# Altium schematic sheet MCU063B_USB.SchDoc
size 431 x 279 mm; Date: Not shown in title block; ApprovedBy: Not shown in title block; CheckedBy: Not shown in title block; Author: Not shown in title block; CompanyName: Not shown in title block; DrawnBy: Cody Watkins; Engineer: Not shown in title block; Organization: Not shown in title block; Address1: Not shown in title block; Address2: Not shown in title block; Address3: Not shown in title block; Address4: Not shown in title block; DocumentNumber: 6; Revision: Use project parameter SCH_Rev; SheetNumber: 6; SheetTotal: 11; PageSetup: Record=PageOptions|CenterHorizontal=True|CenterVertical=True|PrintScale=1.00|XCorrection=1.00|YCorrection=1.00|PrintKind=0|BorderSize=5000000|LeftOffset=0|BottomOffset=0|Orientation=2|PaperLength=1000|PaperWidth=1000|Scale=100|PaperSource=15|PrintQuality=600|MediaType=1|DitherType=10|PaperKind=Letter|PrintScaleMode=1; CurrentTime: Not shown in title block; CurrentDate: Not shown in title block; Time: Not shown in title block; DocumentFullPathAndName: Not shown in title block; DocumentName: Not shown in title block; ModifiedDate: Not shown in title block; ImagePath: Not shown in title block
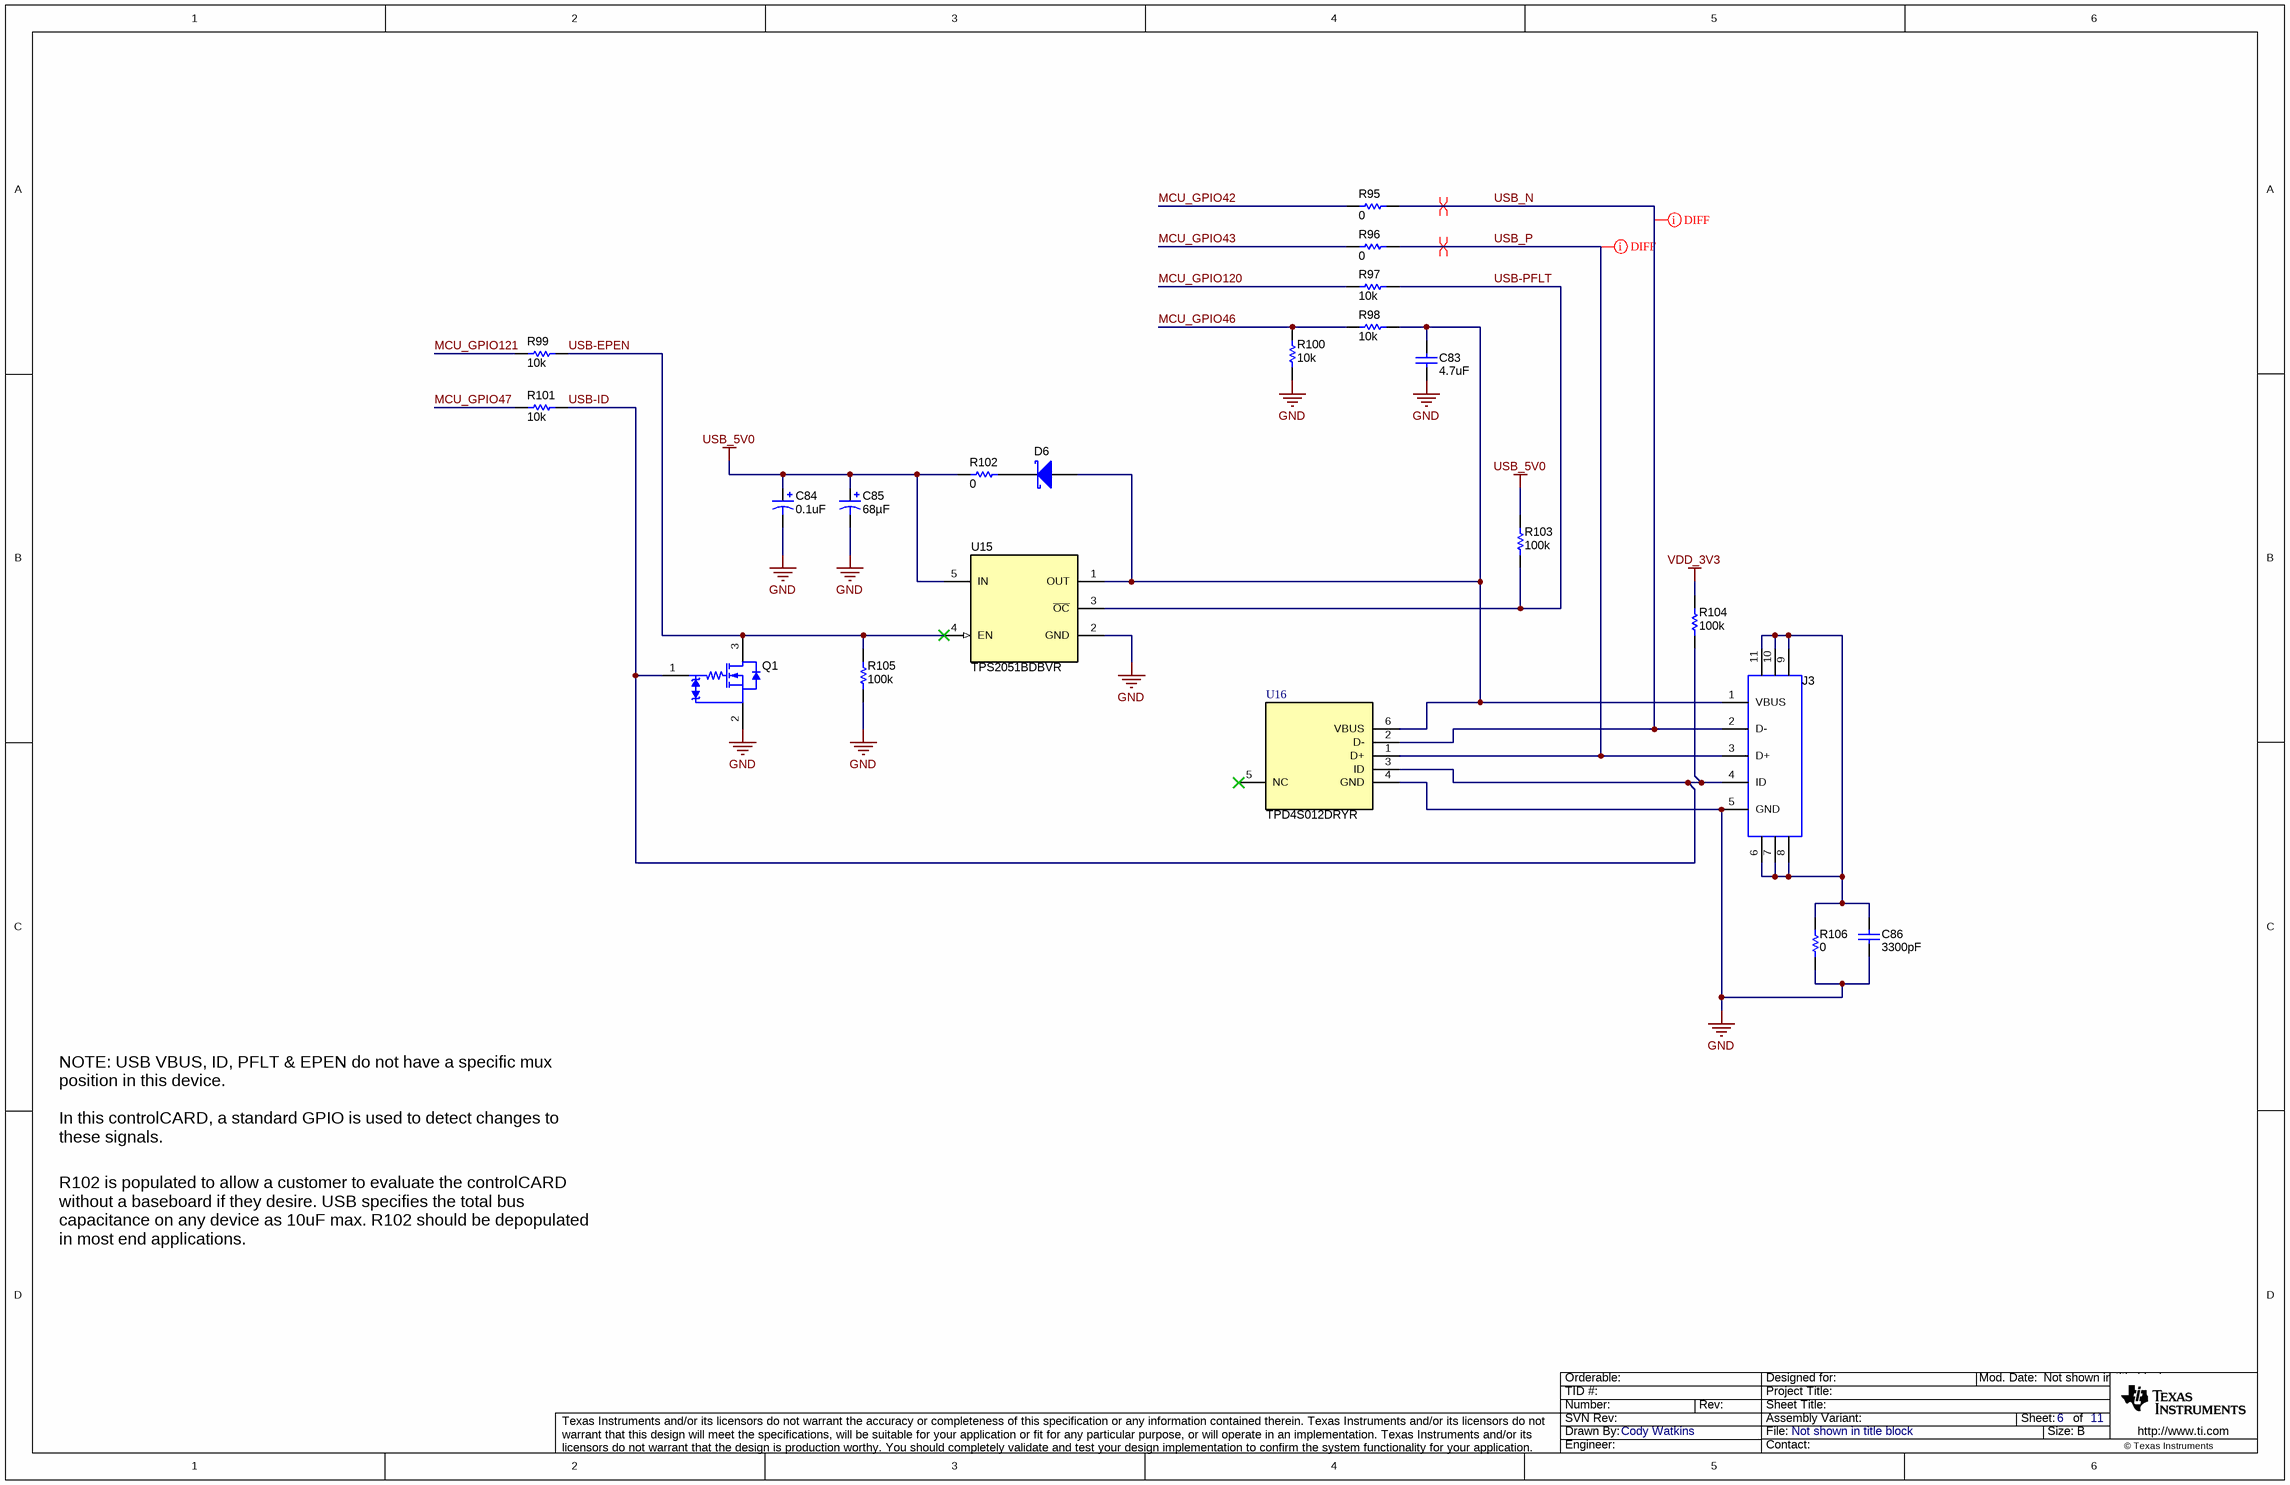
[diagram p0: MCU063B_USB.SchDoc]

## Parts
C83  ValueDisplayed: 4.7uF  [0603]  (hidden comment: C0603C475K9PACTU)
C84  ValueDisplayed: 0.1uF  [3216-18]  (hidden comment: 293D104X9035A2TE3)
C85  ValueDisplayed: 68µF  [3216-18]  (hidden comment: TLJA686M010R1500)
C86  ValueDisplayed: 3300pF  [0402]  (hidden comment: CGA2B2X7R1H332K050BA)
D6  MBRM110ET1G  [POWERMITE]  (value not drawn)
J3  1051640001  [Molex_1051640001]  (value not drawn)
Q1  NTA7002NT1G  [SOT-416]  (value not drawn)
R95  ValueDisplayed: 0  [0402]  (hidden comment: CRCW04020000Z0ED)
R96  ValueDisplayed: 0  [0402]  (hidden comment: CRCW04020000Z0ED)
R97  ValueDisplayed: 10k  [0805_HV]  (hidden comment: ERJ-6GEYJ103V)
R98  ValueDisplayed: 10k  [0805_HV]  (hidden comment: ERJ-6GEYJ103V)
R99  ValueDisplayed: 10k  [0805_HV]  (hidden comment: ERJ-6GEYJ103V)
R100  ValueDisplayed: 10k  [0805_HV]  (hidden comment: ERJ-6GEYJ103V)
R101  ValueDisplayed: 10k  [0805_HV]  (hidden comment: ERJ-6GEYJ103V)
R102  ValueDisplayed: 0  [0402]  (hidden comment: CRCW04020000Z0ED)
R103  ValueDisplayed: 100k  [0603]  (hidden comment: ERJ-3GEYJ104V)
R104  ValueDisplayed: 100k  [0603]  (hidden comment: ERJ-3GEYJ104V)
R105  ValueDisplayed: 100k  [0603]  (hidden comment: ERJ-3GEYJ104V)
R106  ValueDisplayed: 0  [0402]  (hidden comment: CRCW04020000Z0ED)
U15  TPS2051BDBVR  [DBV0005A_N]
U16  TPD4S012DRYR  [DRY0006A]

## Nets
GND: C83.2 C84.2(-) C85.2(-) C86.1 J3.5(GND) Q1.2(S) R100.1 R105.2 R106.2 U15.2(GND) U16.4(GND)
USB_5V0: C84.1(+) C85.1(+) R102.1 R103.1 U15.5(IN)
VDD_3V3: R104.1
MCU_GPIO42: R95.1
MCU_GPIO43: R96.1
MCU_GPIO46: R98.1 R100.2
MCU_GPIO47: R101.1
MCU_GPIO120: R97.1
MCU_GPIO121: R99.1
USB-EPEN: Q1.3(D) R99.2 R105.1 U15.4(EN)
USB-ID: J3.4(ID) Q1.1(G) R101.2 R104.2 U16.3(ID)
USB-PFLT: R97.2 R103.2 U15.3(~{OC})
USB_N: J3.2(D-) R95.2 U16.2(D-)
USB_P: J3.3(D+) R96.2 U16.1(D+)
NetC83_1: C83.1 D6.2(A) J3.1(VBUS) R98.2 U15.1(OUT) U16.6(VBUS)
NetC86_2: C86.2 J3.6 J3.7 J3.8 J3.9 J3.10 J3.11 R106.1
NetD6_1: D6.1(K) R102.2

Not connected (* = marked no-connect by the designer): U16 5(NC)*

## Layout directives
differential pair: USB_N, USB_P
net class USB: USB_N, USB_P

## Notes on the sheet
- NOTE: USB VBUS, ID, PFLT & EPEN do not have a specific mux position in this device.
  In this controlCARD, a standard GPIO is used to detect changes to these signals.
- R102 is populated to allow a customer to evaluate the controlCARD without a baseboard if they desire. USB specifies the total bus capacitance on any device as 10uF max. R102 should be depopulated in most end applications.
- Drawn By:
- SVN Rev:
- Number:
- TID #:
- Orderable:
- Rev:
- Sheet Title:
- File:
- Project Title:
- Designed for:
- Assembly Variant:
- Mod. Date:
- Sheet:
- Size:
- of
- B
- http://www.ti.com
- Texas Instruments and/or its licensors do not warrant the accuracy or completeness of this specification or any information contained therein. Texas Instruments and/or its licensors do not warrant that this design will meet the specifications, will be suitable for your application or fit for any particular purpose, or will operate in an implementation. Texas Instruments and/or its licensors do not warrant that the design is production worthy. You should completely validate and test your design implementation to confirm the system functionality for your application.
- Engineer:
- Contact:
- © Texas Instruments

## Library data of the parts
C83 = CMP-0006950-5: CAP, CERM, 4.7 uF, 6.3 V, +/- 10%, X5R, 0603; Manufacturer: Kemet; TaMin_C: -55°C; ESR_ohm: 6m; Polarized: N; SizeAreaWB_mm2: 4.68; Value1: 0.006 ohm; U/M: EA; Value: 4.7uF; TaMax_C: 85°C; SizeZ_mm: 1; SizeX_mm: 1.6; SizeY_mm: 0.8; Value2: 6.3V; SizeArea_mm2: 1.28; Cap_F: 4.7µF; IRMS_A: 7.24A; AEC Category: Q200; Supplier Part Number 2: 80-C0603C475K9P; Publisher: Texas Instruments; Supplier 2: Mouser; Supplier Part Number 3: 9227784; TempCo: X5R; Supplier 3: Farnell; Published: 2008-06-19; RoHS: Y; MountType: SMT; Supplier 1: Digi-Key; PackageReference: 0603; Tolerance_%: 10%; Cap_Case: 0603; CompType: Capacitor; LatestRevisionDate: 2017-03-09; PartNumber: C0603C475K9PACTU; AEC Qualified: ?; ComponentLink1Description: Datasheet link; Supplier Part Number 1: 399-3482-1-ND; Technology: Ceramic; ComponentLink1URL: http://www.kemet.com/kemet/web/homepage/kechome.nsf/vapubfiles/F3102_Y5V.pdf/$file/F3102_Y5V.pdf
C84 = CMP-0011440-2: CAP, TA, 0.1 uF, 35 V, +/- 10%, 20 ohm, SMD; Manufacturer: Vishay-Sprague; TaMin_C: -55°C; ESR_ohm: 20; Polarized: Y; SizeAreaWB_mm2: 10.92; Value1: 20 ohm; U/M: EA; Value: 0.1uF; TaMax_C: 125°C; SizeZ_mm: 1.8; SizeX_mm: 3.2; SizeY_mm: 1.6; Cap_Case: A; Value2: 35V; SizeArea_mm2: 5.12; CompType: Capacitor; Cap_F: 100nF; IRMS_A: 60mA; AEC Category: Q200; Supplier Part Number 2: 74-293D104X9035A2TE3; Publisher: Texas Instruments; Supplier 2: Mouser; Supplier Part Number 3: 1702743; Supplier 3: Farnell; RoHS: Y; MountType: SMT; Supplier 1: Digi-Key; LatestRevisionNote: Updated supplier links; PackageReference: 3216-18; Tolerance_%: 10%; LatestRevisionDate: 2017-03-09; PartNumber: 293D104X9035A2TE3; AEC Qualified: ?; Series: 293D; ComponentLink1Description: Datasheet link; Supplier Part Number 1: 718-1109-1-ND; Technology: TA; ComponentLink1URL: http://www.vishay.com/docs/40002/293d.pdf
C85 = CMP-0081926-1: CAP, TA, 68 µF, 10 V, +/- 20%, 1.5 ohm, SMD; Manufacturer: AVX; TaMin_C: -55°C; ESR_ohm: 1.5; Polarized: Y; SizeAreaWB_mm2: 10.92; Value1: 1.5 ohm; Value: 68uF; TaMax_C: 125°C; SizeZ_mm: 1.8; SizeX_mm: 3.2; SizeY_mm: 1.6; Value2: 10V; SizeArea_mm2: 5.12; CompType: Capacitor; AEC Qualified: N; IRMS_A: 2.24dA; AEC Category: Q200; ComponentLink1URL: http://datasheets.avx.com/TLJ.pdf; Supplier Part Number 2: 581-TLJA686M010R1500; Supplier 2: Mouser; RoHS: Y; MountType: SMT; Supplier 1: Digi-Key; PackageReference: 3216-18; Tolerance_%: 20%; Cap_Case: 3216-18; PartNumber: TLJA686M010R1500; Series: TLJ; Cap_F: 68µF; ComponentLink1Description: Datasheet link; AEC Grade: N/A; Supplier Part Number 1: 478-4925-1-ND; Technology: TA
C86 = CMP-0006319-2: CAP, CERM, 3300 pF, 50 V, +/- 10%, X7R, AEC-Q200 Grade 1, 0402; Manufacturer: TDK; TaMin_C: -55°C; ESR_ohm: 7.85178d; Polarized: N; SizeAreaWB_mm2: 3; Value1: 0.785178 ohm; U/M: EA; Value: 3300pF; TaMax_C: 125°C; SizeZ_mm: 0.6; SizeX_mm: 1; SizeY_mm: 0.5; Value2: 50V; AEC Qualified: Y; Cap_F: 3.3nF; IRMS_A: 2.72902dA; AEC Category: Q200; Supplier Part Number 2: 810-CGA2B2X7R1H332K050BA; Publisher: Texas Instruments; Supplier 2: Mouser; TempCo: X7R; Published: 2008-06-19; RoHS: Y; MountType: SMT; Supplier 1: Digi-Key; PackageReference: 0402; Tolerance_%: 10%; Cap_Case: 0402; SizeArea_mm2: 0.5; CompType: Capacitor; LatestRevisionDate: 2017-03-09; PartNumber: CGA2B2X7R1H332K050BA; ComponentLink1Description: Datasheet link; AEC Grade: 1; Supplier Part Number 1: 445-6891-1-ND; Technology: Ceramic; ComponentLink1URL: https://product.tdk.com/en/search/capacitor/ceramic/mlcc/info?part_no=CGA2B2X7R1H332K050BA
D6 = CMP-0028747-2: Diode, Schottky, 10 V, 1 A, AEC-Q101, POWERMITE; Manufacturer: ON Semiconductor; Io_A: 1A; Green_Lifecycle: Not Set; SizeAreaWB_mm2: 14.945; Vr_V: 10V; Green_REACh: Incomplete; TJmax_C: 150°C; Value: 10V; SizeZ_mm: 1.15; SizeX_mm: 3.9; SizeY_mm: 2.05; Vf_V: 530mV; Value2: 0.53V; SizeArea_mm2: 7.995; AEC Qualified: Y; AEC Category: Q101; ComponentLink1URL: http://www.onsemi.com/pub_link/Collateral/MBRM110E-D.PDF; RoHS: Y; Value1: 1A; MountType: SMT; Green_EU RoHS-2: Incomplete; Green_EU RoHS: Incomplete; PackageReference: POWERMITE; CompType: Diode; Type: Schottky; PartNumber: MBRM110ET1G; ComponentLink1Description: Datasheet link
J3 = CMP-0055311-1: Receptacle, USB 2.0, Micro B, 5 Position, R/A, SMT; Manufacturer: Molex; CNHeader: FALSE; Current_A: 1.8A; Gender: Female; Voltage_V: 30V; Pitch_mm: 0.65; ContactFinish: Gold; CT: TRUE; Cert_UL: Y; ComponentLink1URL: http://www.molex.com/pdm_docs/sd/1051640001_sd.pdf; Supplier Part Number 2: 99Y3224; Publisher: Texas Instruments; Supplier 2: Newark; Supplier Part Number 3: 538-105164-0001; Color: Black; Supplier 3: Mouser; RoHS: Y; MountType: SMT; Supplier 1: Digi-Key; PackageReference: Receptacle, USB 2.0, Micro B, 5 Pos, 0.65mm Pitch, R/A, SMT; PinCount: 5; CompType: USB; LatestRevisionDate: 26/05/2017; PartNumber: 1051640001; Orientation: R/A; ComponentLink1Description: Datasheet URL; Supplier Part Number 1: WM11263CT-ND
Q1 = CMP-0081965-1: MOSFET, N-CH, 30 V, 0.154 A, AEC-Q101, SOT-416; Manufacturer: ON Semiconductor; Alternate Manufacturer: None; ChType: N; SizeAreaWB_mm2: 6.76; SizeArea_mm2: 2.56; IdsMax_A: 1.54dA; AEC Qualified: Y; VdsMax_V: 30V; Rdson45_ohm: 7; Vgs_V: 10V; AEC Category: Q101; Value: 30V; SizeZ_mm: 0.95; ChMode: Enhancement; SizeY_mm: 1.6; Value2: ? nC; Value1: 7 ohm; ComponentLink1Description: Datasheet link; RoHS: Y; Supplier Part Number 3: 863-NTA7002NT1G; Supplier 1: Digi-Key; PackageReference: SOT-416; PartNumber: NTA7002NT1G; Supplier Part Number 2: 10N9709; Supplier 2: Newark; ComponentLink1URL: https://www.onsemi.com/pub/Collateral/NTA7002N-D.PDF; CompType: MOSFET; MountType: SMT; Supplier Part Number 1: NTA7002NT1GOSCT-ND; SizeX_mm: 1.6; Supplier 3: Mouser
R95 R96 R102 = CMP-0026822-3: RES, 0, 5%, 0.063 W, AEC-Q200 Grade 0, 0402; Manufacturer: Vishay-Dale; Value: 0; Value_Code: 0000; Power_W: 63mW; Value2: 0.063W; VDC_V: 50V; TempCo: 200 ppm/C; SizeArea_mm2: 0.5; SizeX_mm: 1; SizeZ_mm: 0.6; EIA_Code: E24; AEC Category: Q200; AEC Qualified: Y; CompType: Resistor; PartNumber: CRCW04020000Z0ED; PackageReference: 0402; RoHS: E; Res_ohm: 0; Tolerance_%: 5%; Value1: 5%; MountType: SMT; Technology: Thick Film; SizeY_mm: 0.5; ComponentLink1Description: Datasheet link; ComponentLink1URL: http://www.vishay.com/docs/20035/dcrcwe3.pdf; Supplier 1: Digi-Key; Supplier Part Number 1: 541-0.0JCT-ND; Supplier 2: Newark; Supplier Part Number 2: 52K6543; Supplier 3: Mouser; Supplier Part Number 3: 71-CRCW0402-0-E3; AEC Grade: 0
R97-R101 = CMP-0020620-3: RES, 10 k, 5%, 0.125 W, AEC-Q200 Grade 0, 0805; Manufacturer: Panasonic; Power_W: 125mW; TempCo: 200 ppm/C; Value_Code: 10k0; Value: 10k; EIA_Code: E24; SizeX_mm: 2; SizeY_mm: 1.25; SizeZ_mm: 1.45; Value2: 0.125W; SizeArea_mm2: 2.5; AEC Qualified: Y; VDC_V: 150V; AEC Category: Q200; AEC Grade: 0; SizeAreaWB_mm2: 6.75; Supplier Part Number 2: 67T1248; Supplier 2: Newark; Supplier Part Number 3: 667-ERJ-6GEYJ103V; Supplier 3: Mouser; RoHS: Y; Value1: 5%; MountType: SMT; Supplier 1: Digi-Key; PackageReference: 0805; Tolerance_%: 5%; Res_ohm: 10k; CompType: Resistor; PartNumber: ERJ-6GEYJ103V; ComponentLink1Description: Datasheet link; Supplier Part Number 1: P10KACT-ND; Technology: Thick Film; ComponentLink1URL: https://industrial.panasonic.com/cdbs/www-data/pdf/RDA0000/AOA0000C301.pdf
R103-R105 = CMP-0025875-3: RES, 100 k, 5%, 0.1 W, AEC-Q200 Grade 0, 0603; Manufacturer: Panasonic; Power_W: 100mW; TempCo: 200 ppm/C; U/M: EA; Value: 100k; EIA_Code: E24; SizeX_mm: 1.6; SizeY_mm: 0.8; SizeZ_mm: 1; Value2: 0.1W; SizeArea_mm2: 1.28; AEC Qualified: Y; VDC_V: 50V; AEC Grade: 0; AEC Category: Q200; Supplier Part Number 2: 63W0974; Publisher: Texas Instruments; Supplier 2: Newark; Supplier Part Number 3: 667-ERJ-3GEYJ104V; Supplier 3: Mouser; Published: 2008-06-26; Value_Code: 100k; RoHS: Y; Value1: 5%; MountType: SMT; Supplier 1: Digi-Key; PackageReference: 0603; Tolerance_%: 5%; Res_ohm: 100k; CompType: Resistor; LatestRevisionDate: 2017-03-09; PartNumber: ERJ-3GEYJ104V; ComponentLink1Description: Datasheet link; Supplier Part Number 1: P100KGCT-ND; Technology: Thick Film; ComponentLink1URL: http://industrial.panasonic.com/cdbs/www-data/pdf/RDA0000/AOA0000C84.pdf
R106 = CMP-0026822-3: RES, 0, 5%, 0.063 W, AEC-Q200 Grade 0, 0402; Manufacturer: Vishay-Dale; Value: 0; Value_Code: 0000; Power_W: 63mW; Value2: 0.063W; VDC_V: 50V; TempCo: 200 ppm/C; EIA_Code: E24; AEC Category: Q200; AEC Qualified: Y; SizeArea_mm2: 0.5; SizeX_mm: 1; SizeZ_mm: 0.6; CompType: Resistor; PartNumber: CRCW04020000Z0ED; PackageReference: 0402; RoHS: E; Res_ohm: 0; Tolerance_%: 5%; Value1: 5%; MountType: SMT; Technology: Thick Film; ComponentLink1Description: Datasheet link; ComponentLink1URL: http://www.vishay.com/docs/20035/dcrcwe3.pdf; Supplier 1: Digi-Key; Supplier Part Number 1: 541-0.0JCT-ND; Supplier 2: Newark; Supplier Part Number 2: 52K6543; Supplier 3: Mouser; Supplier Part Number 3: 71-CRCW0402-0-E3; AEC Grade: 0; SizeY_mm: 0.5
U15 = CMP-0074276-1: Single, Current-Limited, Power-Distribution Switch, DBV0005A (SOT-23-5); Alternate PartNumber: TPS2051BDBVT; Alternate Manufacturer: Texas Instruments; Green_Lifecycle: Active; SizeAreaWB_mm2: 14.82; Green_REACh: Passed; U/M: EA; SizeZ_mm: 1.45; SizeX_mm: 2.8; SizeY_mm: 2.9; SizeArea_mm2: 8.12; CompType: IC; ComponentLink1URL: http://www.ti.com/lit/ds/symlink/tps2051b.pdf; Publisher: Texas Instruments; PackageDescription: SOT-23-5; RoHS: Y; Footprint Path 6: C:\AltiumLibraries\Footprints\TI\.PcbLib; MountType: SMT; Green_EU RoHS-2: Passed; Manufacturer: Texas Instruments; Green_EU RoHS: Passed; PackageReference: DBV0005A; LatestRevisionDate: 2017-06-09; PartNumber: TPS2051BDBVR; ComponentLink1Description: Datasheet Link
U16 = CMP-0043122-3: 4-Channel USB ESD Solution with Power Clamp, DRY0006A (USON-6); Manufacturer: Texas Instruments; IO Leakage Current(nA): 10; USB High Speed: TRUE; Eco-Plan: Green (RoHS & no Sb/Br); Breakdown Voltage(Min)(V): 6; IO Capacitance(Typ)(pF): 0.8; AEC Category: Q200; AEC Qualified: N; CompType: IC; SizeAreaWB_mm2: 4.9; SizeArea_mm2: 1.45; SizeX_mm: 1.0; SizeZ_mm: 0.6; Rating: Catalog; ComponentLink1Description: Datasheet Link; ComponentLink3URL: http://www.ti.com/product/tpd4s012/datasheet; PackageReference: DRY0006A; PartNumber: TPD4S012DRYR; ComponentLink3Description: Online Datasheet; PackageDescription: USON-6; IEC 61000-4-2 Contact(+/- kV): 10; ComponentLink2Description: Product Folder; ComponentLink1URL: http://www.ti.com/lit/ds/symlink/tpd4s012.pdf; ComponentLink2URL: http://www.ti.com/product/tpd4s012; IEC 61000-4-2 Air-Gap(+/- kV): 10; MountType: SMT; RoHS: Y; SizeY_mm: 1.45; Operating Temperature Range: -40 to 85 C